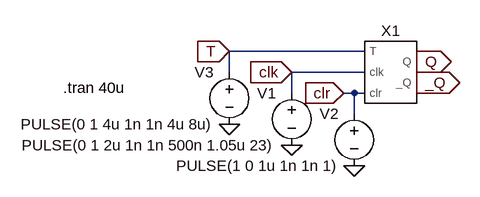
[diagram p0: schematic test-Tflipflop.asc]
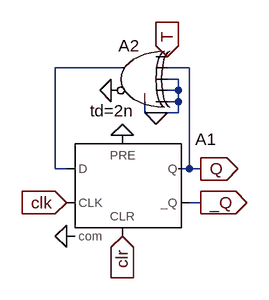
[diagram p1: sub-circuit tflipflop.asc]
test-Tflipflop.asc, the LTspice schematic file:
Version 4
SHEET 1 1396 984
WIRE 160 256 -48 256
WIRE -48 288 -48 256
WIRE 160 288 48 288
WIRE 48 320 48 288
WIRE 144 320 128 320
WIRE 160 320 144 320
WIRE 144 352 144 320
FLAG 48 400 0
FLAG 48 288 clk
IOPIN 48 288 In
FLAG 240 272 Q
IOPIN 240 272 Out
FLAG 240 304 _Q
IOPIN 240 304 Out
FLAG 144 432 0
FLAG 128 320 clr
IOPIN 128 320 In
FLAG -48 368 0
FLAG -48 256 T
IOPIN -48 256 In
SYMBOL voltage 48 304 M0
WINDOW 123 0 0 Left 0
WINDOW 39 0 0 Left 0
SYMATTR InstName V1
SYMATTR Value PULSE(0 1 2u 1n 1n 500n 1.05u 23)
SYMBOL voltage 144 336 M0
WINDOW 123 0 0 Left 0
WINDOW 39 0 0 Left 0
SYMATTR InstName V2
SYMATTR Value PULSE(1 0 1u 1n 1n 1)
SYMBOL voltage -48 272 M0
WINDOW 123 0 0 Left 0
WINDOW 39 0 0 Left 0
SYMATTR InstName V3
SYMATTR Value PULSE(0 1 4u 1n 1n 4u 8u)
SYMBOL tflipflop 192 288 R0
SYMATTR InstName X1
TEXT -304 312 Left 2 !.tran 40u

tflipflop.asc, the sub-circuit schematic file:
Version 4
SHEET 1 1396 984
WIRE 592 224 496 224
WIRE 688 224 656 224
WIRE 672 240 656 240
WIRE 672 256 672 240
WIRE 672 256 656 256
WIRE 672 272 672 256
WIRE 672 272 656 272
WIRE 624 288 624 272
WIRE 640 288 624 288
WIRE 672 288 672 272
WIRE 672 288 640 288
WIRE 496 368 496 224
WIRE 512 368 496 368
WIRE 688 368 688 224
WIRE 688 368 672 368
WIRE 704 368 688 368
WIRE 704 416 688 416
FLAG 704 368 Q
IOPIN 704 368 Out
FLAG 704 416 _Q
IOPIN 704 416 Out
FLAG 592 464 clr
IOPIN 592 464 In
FLAG 656 208 T
IOPIN 656 208 In
FLAG 512 416 clk
IOPIN 512 416 In
FLAG 592 320 0
FLAG 640 288 0
FLAG 576 256 0
FLAG 512 464 0
SYMBOL Digital\\dflop 592 320 R0
SYMATTR InstName A1
SYMBOL Digital\\xor 608 176 M0
WINDOW 3 1 109 Left 2
SYMATTR Value td=2n
SYMATTR InstName A2

The netlist it stands for:
* test-Tflipflop.asc
V1 clk 0 PULSE(0 1 2u 1n 1n 500n 1.05u 23)
V2 clr 0 PULSE(1 0 1u 1n 1n 1)
V3 T 0 PULSE(0 1 4u 1n 1n 4u 8u)
XX1 clk clr T _Q Q tflipflop

* block symbol definitions
.subckt tflipflop clk clr T _Q Q
A1 N001 0 clk 0 clr _Q Q 0 DFLOP
A2 T Q 0 0 0 0 N001 0 XOR td=2n
.ends tflipflop

.tran 40u
.backanno
.end